# EAGLE design PonyProg_ver1 (EAGLE 6.1)
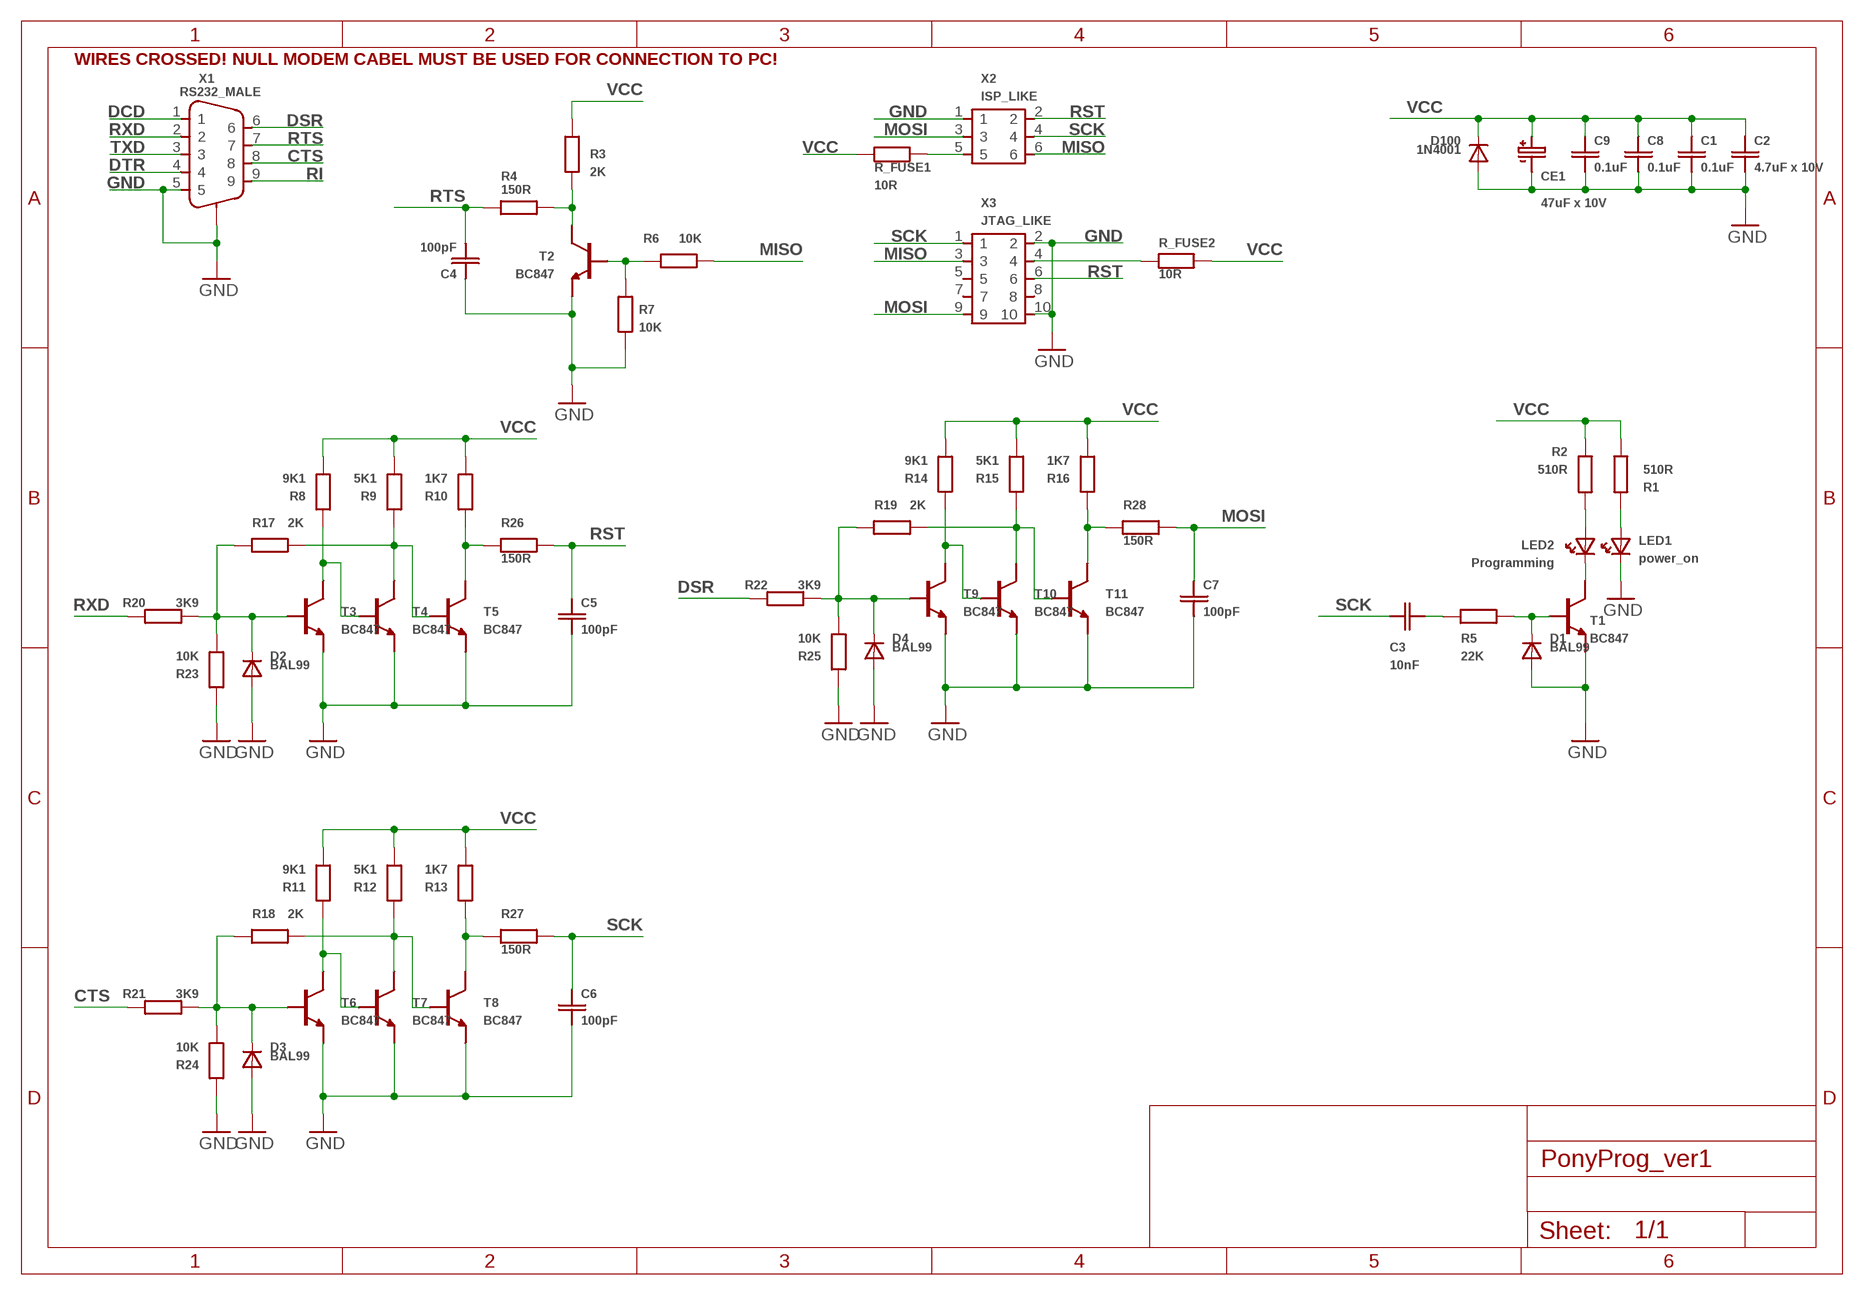
[diagram p0: schematic, sheet 1]

## Parts
C1  0.1uF  CSMD_0805  [RSMD_0805]
C2  4.7uF x 10V  CSMD_1206  [RSMD_1206]
C3  10nF  CSMD_0805  [RSMD_0805]
C4  100pF  CSMD_0805  [RSMD_0805]
C5  100pF  CSMD_0805  [RSMD_0805]
C6  100pF  CSMD_0805  [RSMD_0805]
C7  100pF  CSMD_0805  [RSMD_0805]
C8  0.1uF  CSMD_0805  [RSMD_0805]
C9  0.1uF  CSMD_0805  [RSMD_0805]
CE1  47uF x 10V  CE6.3MM  [CE_6.3MM]
D1  BAL99  BAL99SOT23_SMALL_PADS  [SOT23_SMALL_PADS]
D2  BAL99  BAL99SOT23_SMALL_PADS  [SOT23_SMALL_PADS]
D3  BAL99  BAL99SOT23_SMALL_PADS  [SOT23_SMALL_PADS]
D4  BAL99  BAL99SOT23_SMALL_PADS  [SOT23_SMALL_PADS]
D100  1N4001  1N4001DO-41_20MM  [DO-41_20MM]
LED1  power_on  LED3MM  [LED3MM]
LED2  Programming  LED3MM  [LED3MM]
R1  510R  RSMD_0805  [RSMD_0805]
R2  510R  RSMD_0805  [RSMD_0805]
R3  2K  RSMD_1206  [RSMD_1206]
R4  150R  RSMD_0805  [RSMD_0805]
R5  22K  RSMD_0805  [RSMD_0805]
R6  10K  RSMD_1206  [RSMD_1206]
R7  10K  RSMD_0805  [RSMD_0805]
R8  9K1  RSMD_1206  [RSMD_1206]
R9  5K1  RSMD_0805  [RSMD_0805]
R10  1K7  RSMD_0805  [RSMD_0805]
R11  9K1  RSMD_1206  [RSMD_1206]
R12  5K1  RSMD_0805  [RSMD_0805]
R13  1K7  RSMD_0805  [RSMD_0805]
R14  9K1  RSMD_1206  [RSMD_1206]
R15  5K1  RSMD_0805  [RSMD_0805]
R16  1K7  RSMD_0805  [RSMD_0805]
R17  2K  RSMD_0805  [RSMD_0805]
R18  2K  RSMD_0805  [RSMD_0805]
R19  2K  RSMD_0805  [RSMD_0805]
R20  3K9  RSMD_0805  [RSMD_0805]
R21  3K9  RSMD_0805  [RSMD_0805]
R22  3K9  RSMD_0805  [RSMD_0805]
R23  10K  RSMD_0805  [RSMD_0805]
R24  10K  RSMD_0805  [RSMD_0805]
R25  10K  RSMD_0805  [RSMD_0805]
R26  150R  RSMD_0805  [RSMD_0805]
R27  150R  RSMD_0805  [RSMD_0805]
R28  150R  RSMD_0805  [RSMD_0805]
R_FUSE1  10R  R0207  [R0207]
R_FUSE2  10R  R0207  [R0207]
T1  BC847  BC847SOT23_SMALL_PADS  [SOT23_SMALL_PADS]
T2  BC847  BC847SOT23_SMALL_PADS  [SOT23_SMALL_PADS]
T3  BC847  BC847SOT23_SMALL_PADS  [SOT23_SMALL_PADS]
T4  BC847  BC847SOT23_SMALL_PADS  [SOT23_SMALL_PADS]
T5  BC847  BC847SOT23_SMALL_PADS  [SOT23_SMALL_PADS]
T6  BC847  BC847SOT23_SMALL_PADS  [SOT23_SMALL_PADS]
T7  BC847  BC847SOT23_SMALL_PADS  [SOT23_SMALL_PADS]
T8  BC847  BC847SOT23_SMALL_PADS  [SOT23_SMALL_PADS]
T9  BC847  BC847SOT23_SMALL_PADS  [SOT23_SMALL_PADS]
T10  BC847  BC847SOT23_SMALL_PADS  [SOT23_SMALL_PADS]
T11  BC847  BC847SOT23_SMALL_PADS  [SOT23_SMALL_PADS]
X1  RS232_MALE  DSUB9_MALE  [DSUB9_RA_MALE]
X2  ISP_LIKE  PIN2X3_2.54MM  [PIN2X3_2.54MM]
X3  JTAG_LIKE  PIN2X5_2.54MM  [PIN2X5_2.54MM]

## Nets
CTS: R21.PAD_1(PIN1) X1.8
DCD: X1.1
DSR: R22.PAD_1(PIN1) X1.6
DTR: X1.4
GND: C1.PAD_0(PIN0) C2.PAD_0(PIN0) C4.PAD_1(PIN1) C5.PAD_0(PIN0) C6.PAD_0(PIN0) C7.PAD_0(PIN0) C8.PAD_0(PIN0) C9.PAD_0(PIN0) CE1.- D1.3(ANODE) D2.3(ANODE) D3.3(ANODE) D4.3(ANODE) D100.ANODE LED1.CATHODE R7.PAD_0(PIN0) R23.PAD_1(PIN1) R24.PAD_1(PIN1) R25.PAD_1(PIN1) T1.2(E) T2.2(E) T3.2(E) T4.2(E) T5.2(E) T6.2(E) T7.2(E) T8.2(E) T9.2(E) T10.2(E) T11.2(E) X1.5 X1.PACKAGE1 X1.PACKAGE2(PACKAGE1) X2.1 X3.2 X3.10
MISO: R6.PAD_1(PIN1) X2.6 X3.3
MOSI: C7.PAD_1(PIN1) R28.PAD_0(PIN0) X2.3 X3.9
N$1: D3.2(CATHODE) R18.PAD_1(PIN1) R21.PAD_0(PIN0) R24.PAD_0(PIN0) T6.1(B)
N$2: R11.PAD_1(PIN1) T6.3(C) T7.1(B)
N$3: R12.PAD_1(PIN1) R18.PAD_0(PIN0) T7.3(C) T8.1(B)
N$4: D2.2(CATHODE) R17.PAD_1(PIN1) R20.PAD_0(PIN0) R23.PAD_0(PIN0) T3.1(B)
N$5: C3.PAD_0(PIN0) R5.PAD_0(PIN0)
N$6: D1.2(CATHODE) R5.PAD_1(PIN1) T1.1(B)
N$7: R8.PAD_1(PIN1) T3.3(C) T4.1(B)
N$8: R9.PAD_1(PIN1) R17.PAD_0(PIN0) T4.3(C) T5.1(B)
N$9: LED1.ANODE R1.PAD_1(PIN1)
N$10: LED2.ANODE R2.PAD_1(PIN1)
N$11: D4.2(CATHODE) R19.PAD_1(PIN1) R22.PAD_0(PIN0) R25.PAD_0(PIN0) T9.1(B)
N$12: R14.PAD_1(PIN1) T9.3(C) T10.1(B)
N$13: R15.PAD_1(PIN1) R19.PAD_0(PIN0) T10.3(C) T11.1(B)
N$14: R10.PAD_1(PIN1) R26.PAD_1(PIN1) T5.3(C)
N$15: R13.PAD_1(PIN1) R27.PAD_1(PIN1) T8.3(C)
N$16: LED2.CATHODE T1.3(C)
N$17: R6.PAD_0(PIN0) R7.PAD_1(PIN1) T2.1(B)
N$18: R3.PAD_0(PIN0) R4.PAD_0(PIN0) T2.3(C)
N$19: R16.PAD_1(PIN1) R28.PAD_1(PIN1) T11.3(C)
N$21: R_FUSE2.PAD_0(PIN0) X3.4
N$22: R_FUSE1.PAD1(PIN1) X2.5
RI: X1.9
RST: C5.PAD_1(PIN1) R26.PAD_0(PIN0) X2.2 X3.6
RTS: C4.PAD_0(PIN0) R4.PAD_1(PIN1) X1.7
RXD: R20.PAD_1(PIN1) X1.2
SCK: C3.PAD_1(PIN1) C6.PAD_1(PIN1) R27.PAD_0(PIN0) X2.4 X3.1
TXD: X1.3
VCC: C1.PAD_1(PIN1) C2.PAD_1(PIN1) C8.PAD_1(PIN1) C9.PAD_1(PIN1) CE1.+ D100.CATHODE R1.PAD_0(PIN0) R2.PAD_0(PIN0) R3.PAD_1(PIN1) R8.PAD_0(PIN0) R9.PAD_0(PIN0) R10.PAD_0(PIN0) R11.PAD_0(PIN0) R12.PAD_0(PIN0) R13.PAD_0(PIN0) R14.PAD_0(PIN0) R15.PAD_0(PIN0) R16.PAD_0(PIN0) R_FUSE1.PAD_0(PIN0) R_FUSE2.PAD1(PIN1)
Unconnected: X3.5 X3.7 X3.8

## Notes on the sheet
- WIRES CROSSED! NULL MODEM CABEL MUST BE USED FOR CONNECTION TO PC!

## Library data of the parts
C1-C9 = __MyCommonLib1:C
CE1 = __MyCommonLib1:CE
D1-D4 = __MyCommonLib1:BAL99
D100 = __MyCommonLib1:1N4001
LED1 LED2 = __MyCommonLib1:LED3MM
R1-R28 R_FUSE1 R_FUSE2 = __MyCommonLib1:R
T1-T11 = __MyCommonLib1:BC847
X1 = __MyCommonLib1:DSUB9
X2 = __MyCommonLib1:PIN2X3
X3 = __MyCommonLib1:PIN2X5

## Board
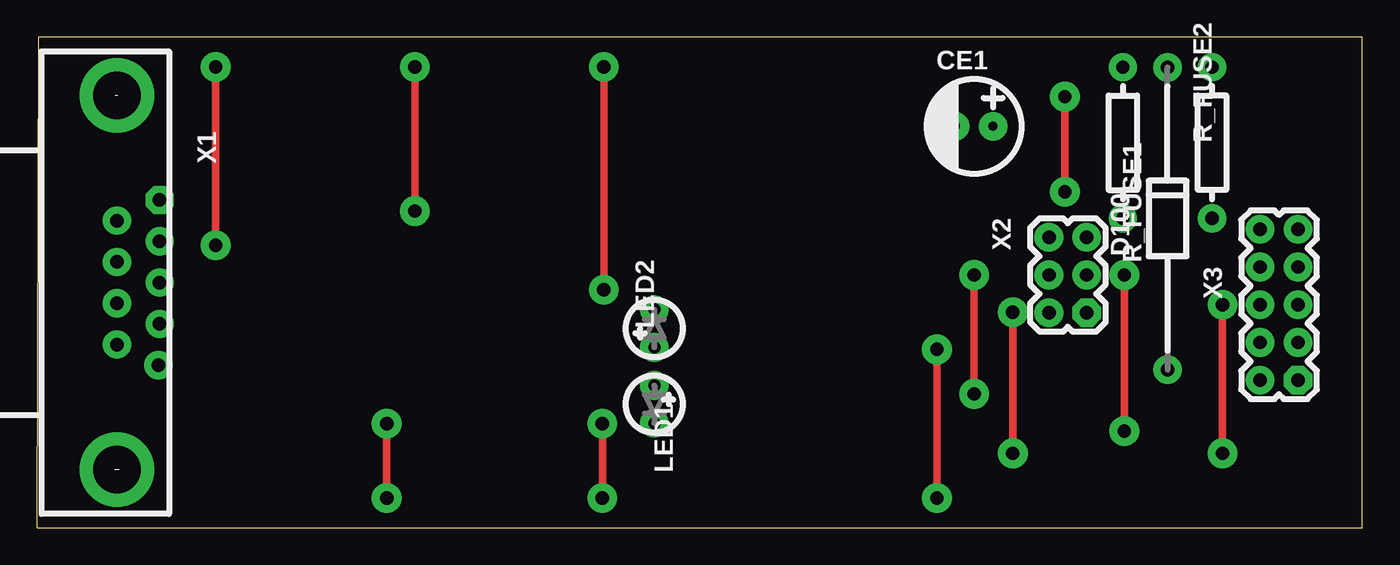
[diagram p1: board, top side]
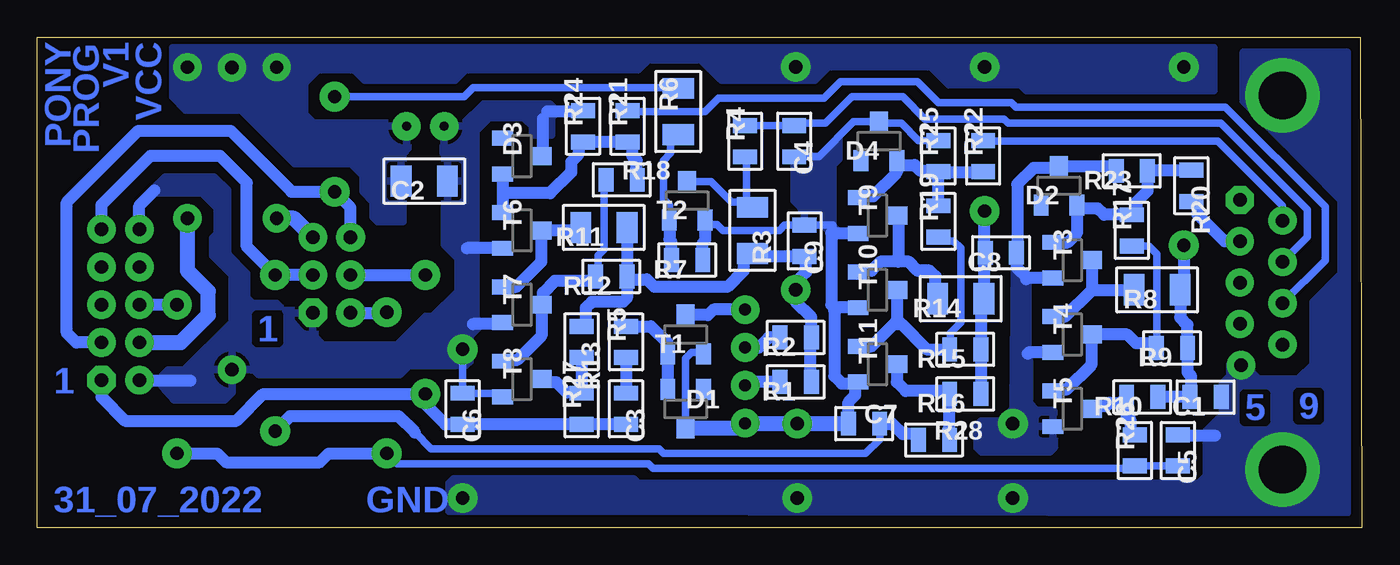
[diagram p2: board, bottom side, seen from below]

Size 89.1 x 33 mm. Coordinates in mm from the lower left corner, seen from the top.
Outline: 0,0 89.1,0 89.1,33 0.1,33 0,0
Copper layers (1*16): Top 0.035mm / dielectric 1.5mm / Bottom 0.035mm
Design rules: minimum track width 0.5mm, minimum drill 0.6mm, track to track 0.35mm, track to pad 0.35mm, pad to pad 0.35mm, via to via 0.35mm, smd to smd 0mil, copper to edge 0.2mm, drill to drill 1mm, minimum pad ring 0.35mm, minimum via ring 0.35mm, stop-mask expansion 4mil, vias tented up to drill 0mil, thermal gap 10mil

### Footprints (pad centres in the part's own frame; a part is rotated, then mirrored left to right if it is on the bottom)
RSMD_0805 = smd 1 x 1.6: PAD_0 -1.05,0; PAD_1 1.05,0
RSMD_1206 = smd 1.4 x 2.1: PAD_0 -1.55,0; PAD_1 1.55,0
CE_6.3MM = drill 0.6 pad 1.93: + 1.27,0; - -1.27,0
SOT23_SMALL_PADS = smd 1 x 1.4: 1 1.2,1.3; 2 -1.2,1.3 | smd 1.2 x 1.4: 3 0,-1.3
DO-41_20MM = drill 0.9 pad 1.93: ANODE -10.16,0; CATHODE 10.16,0
LED3MM = drill 0.8 pad 1.93: ANODE -1.27,0; CATHODE 1.27,0
R0207 = drill 0.9 pad 1.9: PAD1 5.08,0; PAD_0 -5.08,0
DSUB9_RA_MALE = drill 0.9 pad 1.9 octagon: 1 -5.556,0 | drill 0.9 pad 1.9: 2 -2.778,0; 3 0,0; 4 2.778,0; 5 5.556,-0.079; 6 -4.167,-2.857; 7 -1.389,-2.857; 8 1.389,-2.857; 9 4.167,-2.857 | drill 3.2 pad 5: PACKAGE1 -12.581,-2.857; PACKAGE2 12.581,-2.857
PIN2X3_2.54MM = drill 0.9 pad 1.93 octagon: 1 -2.54,-1.27 | drill 0.9 pad 1.93: 2 -2.54,1.27; 3 0,-1.27; 4 0,1.27; 5 2.54,-1.27; 6 2.54,1.27
PIN2X5_2.54MM = drill 0.9 pad 1.93 octagon: 1 -5.08,-1.27 | drill 0.9 pad 1.93: 2 -5.08,1.27; 3 -2.54,-1.27; 4 -2.54,1.27; 5 0,-1.27; 6 0,1.27; 7 2.54,-1.27; 8 2.54,1.27; 9 5.08,-1.27; 10 5.08,1.27

### Placement (x,y rotation side)
C1  10.54,8.79 180 bottom
C2  63.07,23.32 180 bottom
C3  49.5,8 270 bottom
C4  38.2,26 270 bottom
C5  12.4,5.2 270 bottom
C6  60.5,8 270 bottom
C7  33.5,7 0 bottom
C8  24.3,18.5 180 bottom
C9  37.5,19.3 270 bottom
CE1  63,27 0 top
D1  45.5,8 0 bottom
D2  20.4,23 180 bottom
D3  56.5,25 90 bottom
D4  32.5,26 180 bottom
D100  76,20.8 90 top
LED1  41.5,8.3 270 top
LED2  41.5,13.4 90 top
R1  38.1,9.8 180 bottom
R2  38.1,12.8 180 bottom
R3  41,20 270 bottom
R4  41.5,26 90 bottom
R5  49.5,12.5 90 bottom
R6  46,28 90 bottom
R7  45.4,18 180 bottom
R8  13.8,16 180 bottom
R9  12.8,12.1 180 bottom
R10  14.8,8.8 180 bottom
R11  51,20.2 180 bottom
R12  50.5,16.9 180 bottom
R13  52.5,12.5 270 bottom
R14  27,15.4 180 bottom
R15  26.7,12 180 bottom
R16  26.7,9 180 bottom
R17  15.5,20 90 bottom
R18  49.8,23.4 0 bottom
R19  28.5,20.6 90 bottom
R20  11.5,23 270 bottom
R21  49.4,27 90 bottom
R22  25.5,25 90 bottom
R23  15.5,24 180 bottom
R24  52.4,27 90 bottom
R25  28.5,25 90 bottom
R26  15.3,5.2 90 bottom
R27  52.5,8 90 bottom
R28  28.8,5.9 0 bottom
R_FUSE1  73,25.9 270 top
R_FUSE2  79,25.9 90 top
T1  45.5,13 180 bottom
T2  45.4,22 180 bottom
T3  19.5,18 90 bottom
T4  19.5,13 90 bottom
T5  19.5,8 90 bottom
T6  56.5,20 90 bottom
T7  56.5,15 90 bottom
T8  56.5,10 90 bottom
T9  32.6,21 90 bottom
T10  32.6,16 90 bottom
T11  32.6,11 90 bottom
X1  8.23,16.49 270 top
X2  69.3,17 90 top
X3  83.5,15 90 top

### Tracks (layer width: path | path; a pad name or v marks a point on that pad's centre or on a via)
CTS
  Bottom 0.5: X1.8 2.5,17.97 2.5,21.6 9.2,28.3 23.3,28.3 23.6,28.6 28.5,28.6 29.9,30 35.1,30 36.2,28.9 43.3,28.9 44.2,28 49.35,28 R21.PAD_1
DSR
  Bottom 0.5: X1.6 5.37,21.67 9.7,26 25.45,26 R22.PAD_1
GND  (via drill 0.9 pad 2)
  Top 0.5: v23.5,2 v23.5,7 | v38,7 v38,2 | v60.5,12 v60.5,2
  Bottom 0.5: T8.2 58.05,9.05 C6.PAD_0 v60.5,12 | 45.5,6.95 D1.3 45.5,11.4 45.1,11.8 44.4,11.8 T1.2 | R25.PAD_1 29.85,26.05 31,27.2 32.4,27.2 D4.3 34.2,27.3 36.55,24.95 C4.PAD_1 | C5.PAD_0 12.35,6.3 | T2.2 43.9,20.4 43.4,20.4 43,20 39.2,20 38.85,20.35 C9.PAD_0 35.6,20.35 35.6,19.8
  Bottom 0.8: R24.PAD_1 52.45,28 54.8,28 | D3.3 55.1,25.1 55.1,27.5 | T6.2 60.2,18.8 | X3.10 82.23,21.67 81.2,22.7 | R23.PAD_1 16.85,24.3 D2.3 20.5,24.2 22.1,24.2 23.2,23.1 23.2,18.55 C8.PAD_0 23.25,17.55 22.5,16.8 | T3.2 22.5,16.8 | 22.5,16.8 22.6,16.7 | T4.2 22.4,11.8 22.5,11.7 | T9.2 35.6,19.8 35.7,19.8 35.7,15 35.5,14.8 35.5,14.6 | 35.5,14.6 35.5,10.2 35,9.7 34,9.7 T11.2 34.1,9.6 34.1,8.9 34.55,8.45 C7.PAD_0 | T10.2 35.3,14.8 35.5,14.6 | T7.2 57.9,13.7 59.8,13.7 | X3.2 82.21,9.9 78.8,9.9 | 12.35,6.3 12.25,6.2 9.9,6.2 | R7.PAD_0 44.35,19.15 44.2,19.3 T2.2
  Bottom 1: C7.PAD_0 v38,7 41.47,7 LED1.CATHODE 41.83,6.7 D1.3
  pour Bottom (no thermals): 1,32 1,1 61.4,1.1 61.4,3 61.1,3.3 49,3.3 48.7,3 11,3 10.5,3.5 10.5,6.5 9.4,7.6 9.4,9.7 8.9,10.2 8.9,11 8,11 7,10 4.3,10 3.3,11 3.3,15.2 1.4,17.1 1.4,22 8,28.7 8,32
  pour Bottom: 60,12.9 60,11.2 60.3,10.9 64.1,10.9 64.7,10.3 74.2,10.3 74.5,10.6 76,10.6 76,9.1 76.5,8.6 79.9,8.6 80.7,9.5 80.7,10.2 80.3,10.6 79.2,10.6 76,13.8 76,17 77.3,18.3 77.3,19.5 77,19.8 77,21.5 78,22.5 81.3,22.5 81.3,22.8 80.5,23.6 77.2,23.6 76.3,22.7 76.3,18.4 75,17.1 75,15.5 74.6,15.1 73,15.1 72.5,14.6 70.7,14.6 70.4,14.3 70.4,12.9 69.9,12.3 64.9,12.3 63,14.2 62.5,14.2 60.8,15.9 60.8,18.1 61.7,19 61.7,25.1 61.8,25.2 61.8,27.1 60.5,27.1 59.1,28.5 54.6,28.5 54.1,28 54.5,27.6 54.5,26.4 55.8,26.4 55.8,27 56.4,27.6 58.7,27.6 59.6,26.7 59.6,14.1 59.2,13.7
  pour Bottom: 20.7,7.8 20.7,5.4 21,5.1 25.6,5.1 25.9,5.4 25.9,6.9 25.6,7.2 24.3,7.2 23.5,8 23.4,17.8 22.5,16.9 22.5,12.1 22.2,11.8 22.4,11.6 22.4,8.4 21.9,7.9 20.8,7.9
  pour Bottom: 38.2,25 38.2,22 37.7,21.5 37.7,20.4 36.3,20.4 35.8,19.9 35.2,19.9 35.6,20.3 35.6,24.4 35.2,24.8 35.2,26.3 36.5,25 37.2,25
MISO  (via drill 0.9 pad 2)
  Top 0.5: v69.1,22.6 v69.1,29
  Bottom 0.5: v69.1,29 60.4,29 59.8,29.6 46.05,29.6 R6.PAD_1
  Bottom 0.8: X2.6 68.03,21.53 v69.1,22.6 72,22.6 76.1,26.7 82.3,26.7 87.1,21.9 87.1,13.1 86.46,12.46 X3.3
MOSI  (via drill 0.9 pad 2)
  Top 0.5: v73.1,17 v73.1,6.5
  Bottom 0.5: 63.7,6.4 62.6,5.3 47.3,5.3 47,5 33.4,5 32.45,5.95 C7.PAD_1
  Bottom 0.8: 63.7,6.4 64.8,7.5 72.1,7.5 v73.1,6.5 | X2.3 v73.1,17 75,18.9 75,23.2 76.8,25 81.5,25 84.77,21.73 X3.9 | R28.PAD_0 29.85,6.3 30.9,6.3 31.6,7 C7.PAD_1
N$1
  Bottom 0.8: R18.PAD_1 48.8,23.45 48.8,24.7 49.1,25 49.1,25.65 R21.PAD_0 R24.PAD_0 52.7,25.95 52.7,25.1 53.2,24.6 53.2,23.9 54.6,22.5 57.8,22.5 | D3.2 57.8,22.5 | 57.8,22.5 T6.1
N$2
  Bottom 0.8: T7.1 56.9,16.2 55.2,17.9 T6.3 52.75,20 R11.PAD_1
N$3
  Bottom 0.5: R18.PAD_0 51,23.25 51,18.7 51.4,18.3 51.4,17.05 R12.PAD_1
  Bottom 0.8: T8.1 57.7,11.3 56.8,11.3 55.2,12.9 T7.3 55.1,15.1 55.1,15.8 54.3,16.6 51.85,16.6 R12.PAD_1
N$4
  Bottom 0.8: R20.PAD_0 14.4,24.05 R23.PAD_0 14.45,22.65 15.2,21.9 15.2,21.35 R17.PAD_1 17.35,21.05 17.8,21.5 19,21.5 D2.2 19.2,19.8 19.8,19.2 T3.1
N$5
  Bottom 0.8: R5.PAD_0 C3.PAD_0
N$6
  Bottom 0.8: D1.2 T1.1 46.7,12.4 47.85,13.55 R5.PAD_1
N$7
  Bottom 0.8: T4.1 20,14.2 18.2,16 | 18.2,16 R8.PAD_1 15.3,16 | T3.3 18.2,16
N$8
  Bottom 0.5: R17.PAD_0 14.35,18.95 13.8,18.4 13.8,12.15 R9.PAD_1
  Bottom 0.8: T5.1 20.7,9.3 19.9,9.3 18.2,11 T4.3 15.8,13 15.2,12.4 14.15,12.4 R9.PAD_1
N$9
  Bottom 0.8: R1.PAD_1 41.27,9.8 LED1.ANODE
N$10
  Bottom 0.8: R2.PAD_1 39.9,12.8 40.6,12.1 41.47,12.1 LED2.ANODE
N$11
  Bottom 0.8: R22.PAD_0 25.55,23.9 28.45,23.9 | 28.45,23.9 28.5,23.9 | R19.PAD_1 R25.PAD_0 | R25.PAD_0 28.5,24 29.7,24 30.1,24.4 31.3,24.4 D4.2 31.3,23.9 32.9,22.3 33.8,22.3 T9.1 | R25.PAD_0 28.45,23.9
N$12
  Bottom 0.8: R14.PAD_1 28.7,15.55 28.7,16.9 29.1,17.3 29.9,17.3 30.5,17.9 31.2,17.9 | 31.2,17.9 32.4,17.9 33,17.3 33.7,17.3 33.8,17.2 T10.1 | T9.3 31.2,20.9 31.2,17.9
N$13
  Bottom 0.5: 27.7,12.1 27.7,13.1 27,13.8 27,18.8 27.5,19.3 28.25,19.3 R19.PAD_0
  Bottom 0.8: T10.3 31.3,14 31,13.7 | 31,13.7 29.3,12 R15.PAD_1 27.75,12.05 27.7,12.1 | T11.1 33,12.2 31.5,13.7 31,13.7
N$14
  Bottom 0.8: R26.PAD_1 15.35,6.25 15.6,6.5 15.6,7.3 15.85,7.55 R10.PAD_1 16.2,8.45 16.2,8.4 17,8.4 17.2,8.2 18,8.2 T5.3
N$15
  Bottom 0.8: R13.PAD_1 R27.PAD_1 52.55,9.1 53.5,9.1 54.2,9.8 55,9.8 T8.3
N$16
  Bottom 0.8: LED2.CATHODE 43.63,14.67 44,14.3 T1.3
N$17
  Bottom 0.5: T2.1 46.6,21.7 47,22.1 47,24.7 46.5,25.2 46.5,25.95 R6.PAD_0
  Bottom 0.8: R7.PAD_1 46.45,19.25 46.6,19.4 T2.1
N$18
  Bottom 0.5: R3.PAD_0 41.35,21.9 41.4,21.9 | 41.4,21.9 42.4,21.9 43.8,23.3 T2.3 | R4.PAD_0 41.4,24.85 41.4,21.9
N$19
  Bottom 0.8: R28.PAD_1 27.8,5.95 27.8,8.95 R16.PAD_1 27.95,9.2 30.7,9.2 31.3,9.8 T11.3
N$21
  Bottom 1: X3.4 79.44,12.46 77.6,14.3 77.6,15.9 79,17.3 R_FUSE2.PAD_0
N$22
  Bottom 1: X2.5 71.85,20.82 R_FUSE1.PAD1
RST  (via drill 0.9 pad 2)
  Top 0.5: v65.6,14.5 v65.6,5 | v79.7,15 v79.7,5
  Bottom 0.5: C5.PAD_1 R26.PAD_0 15.45,4 47.7,4 48,4.3 64.9,4.3 v65.6,5
  Bottom 0.8: v79.7,5 77,5 76.4,4.4 70.1,4.4 69.5,5 v65.6,5 | X2.2 65.64,14.46 v65.6,14.5 | X3.6 v79.7,15
RTS
  Bottom 0.5: X1.7 3.7,19.55 3.7,21.4 9.5,27.2 23.8,27.2 24.1,27.5 29.4,27.5 30.9,29 34.3,29 36.1,27.2 38.05,27.2 C4.PAD_0 R4.PAD_1
RXD
  Bottom 0.8: X1.2 9.27,19.27 11.1,21.1 11.1,21.8 11.25,21.95 R20.PAD_1
SCK  (via drill 0.9 pad 2)
  Top 0.5: v63,9 v63,17
  Bottom 0.8: X2.4 v63,17 | X3.1 84.77,8.77 83.2,7.2 75.7,7.2 73.9,9 v63,9 63,8.3 61.65,6.95 C6.PAD_1 R27.PAD_0 52.45,6.9 52.4,6.9 52.35,6.95 C3.PAD_1
VCC  (via drill 0.9 pad 2)
  Top 0.5: v12,19 v12,31 | v25.4,21.3 v25.4,31 | v38.1,16 v38.1,31
  Bottom 0.8: R1.PAD_0 37.1,9.85 37.1,12.8 R2.PAD_0 | R2.PAD_0 37.05,14.15 38.1,15.2 v38.1,16 38.1,16.5 37.4,17.2 37.4,18.15 C9.PAD_1 40.8,18.25 R3.PAD_1 41.6,17.85 41.6,17.3 42.7,16.2 47.6,16.2 48.1,16.7 49.25,16.7 R12.PAD_0 | R14.PAD_0 25.65,15.2 | R14.PAD_0 25.45,18.4 C8.PAD_1 25.4,18.55 v25.4,21.3 | R10.PAD_0 C1.PAD_1 11.5,8.88 11.5,10.2 11.75,10.45 R9.PAD_0 11.75,13.65 12.25,14.15 R8.PAD_0 12,16.25 v12,19 | R2.PAD_0 37,12.8 | R11.PAD_0 R12.PAD_0 | R12.PAD_0 49.45,15.45 49.7,15.2 51.8,15.2 52.2,14.8 52.2,13.85 R13.PAD_0 | R16.PAD_0 25.6,9.05 25.6,11.95 R15.PAD_0 25.6,12.05 25.6,15.25 R14.PAD_0
  pour Bottom (no thermals): 10,32.3 10,29.4 22.6,29.4 23,29.8 27.8,29.8 29,31 35.9,31 36.8,30.1 43.1,30.1 44.5,31.5 48,31.5 48.7,30.8 60.3,30.8 61,30.1 67.1,30.1 67.8,30.8 70.2,30.8 71.1,29.9 71.1,27.7 72,28.6 72,29 80,29 80,32.3
  pour Bottom: 64.1,27.2 64.1,25.6 64.5,25.1 64.5,20.6 66.2,20.6 66.5,20.9 66.5,21.9 67.2,22.6 67.2,23.7 68,24.5 71.8,24.5 75.4,28.1 79.1,28.1 80,29 72.3,29 70.5,27.2

### Text on the board
Bottom: VCC | V1 | PROG | PONY | 1 | 1 | 9 | 5 | GND | 31_07_2022